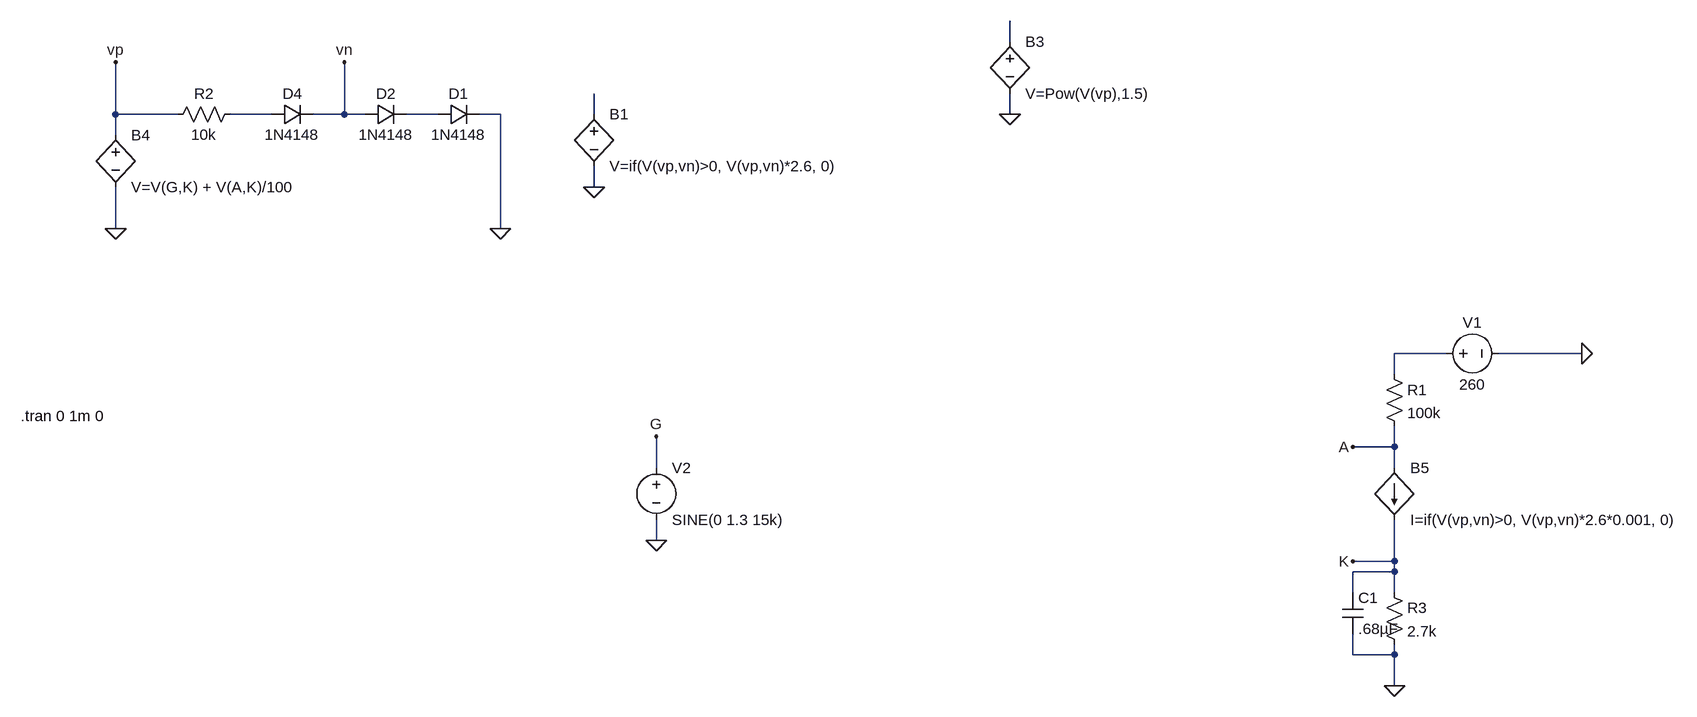
[diagram p0: schematic Test.asc]
Test.asc, the LTspice schematic file:
Version 4
SHEET 1 3920 996
WIRE 2832 -16 2832 -48
WIRE 1456 96 1456 16
WIRE 1552 96 1456 96
WIRE 1696 96 1632 96
WIRE 1808 96 1808 16
WIRE 1808 96 1760 96
WIRE 1840 96 1808 96
WIRE 1952 96 1904 96
WIRE 2048 96 2016 96
WIRE 2192 96 2192 64
WIRE 2832 96 2832 64
WIRE 1456 128 1456 96
WIRE 2192 208 2192 176
WIRE 1456 272 1456 208
WIRE 2048 272 2048 96
WIRE 3504 464 3424 464
WIRE 3712 464 3584 464
WIRE 3424 496 3424 464
WIRE 3424 608 3424 576
WIRE 3424 608 3360 608
WIRE 2288 640 2288 592
WIRE 3424 640 3424 608
WIRE 2288 752 2288 720
WIRE 3424 784 3424 720
WIRE 3424 784 3360 784
WIRE 3424 800 3424 784
WIRE 3424 800 3360 800
WIRE 3360 832 3360 800
WIRE 3424 832 3424 800
WIRE 3360 928 3360 896
WIRE 3424 928 3424 912
WIRE 3424 928 3360 928
WIRE 3424 976 3424 928
FLAG 2048 272 0
FLAG 1456 16 vp
FLAG 1808 16 vn
FLAG 2192 208 0
FLAG 2832 96 0
FLAG 1456 272 0
FLAG 3424 976 0
FLAG 3712 464 0
FLAG 2288 592 G
FLAG 2288 752 0
FLAG 3360 608 A
FLAG 3360 784 K
SYMBOL res 1648 80 R90
WINDOW 0 0 56 VBottom 2
WINDOW 3 32 56 VTop 2
SYMATTR InstName R2
SYMATTR Value 10k
SYMBOL diode 1840 112 R270
WINDOW 0 32 32 VTop 2
WINDOW 3 0 32 VBottom 2
SYMATTR InstName D2
SYMATTR Value 1N4148
SYMBOL diode 1696 112 R270
WINDOW 0 32 32 VTop 2
WINDOW 3 0 32 VBottom 2
SYMATTR InstName D4
SYMATTR Value 1N4148
SYMBOL bv 2192 80 R0
SYMATTR InstName B1
SYMATTR Value V=if(V(vp,vn)>0, V(vp,vn)*2.6, 0)
SYMBOL bv 2832 -32 R0
SYMATTR InstName B3
SYMATTR Value V=Pow(V(vp),1.5)
SYMBOL diode 1952 112 R270
WINDOW 0 32 32 VTop 2
WINDOW 3 0 32 VBottom 2
SYMATTR InstName D1
SYMATTR Value 1N4148
SYMBOL bv 1456 112 R0
SYMATTR InstName B4
SYMATTR Value V=V(G,K) + V(A,K)/100
SYMBOL bi 3424 640 R0
SYMATTR InstName B5
SYMATTR Value I=if(V(vp,vn)>0, V(vp,vn)*2.6*0.001, 0)
SYMBOL res 3408 480 R0
SYMATTR InstName R1
SYMATTR Value 100k
SYMBOL voltage 3488 464 R270
WINDOW 0 32 56 VTop 2
WINDOW 3 -32 56 VBottom 2
WINDOW 123 0 0 Left 0
WINDOW 39 0 0 Left 0
SYMATTR InstName V1
SYMATTR Value 260
SYMBOL voltage 2288 624 R0
WINDOW 123 0 0 Left 0
WINDOW 39 0 0 Left 0
SYMATTR InstName V2
SYMATTR Value SINE(0 1.3 15k)
SYMBOL res 3408 816 R0
SYMATTR InstName R3
SYMATTR Value 2.7k
SYMBOL cap 3344 832 R0
SYMATTR InstName C1
SYMATTR Value .68µF
TEXT 1310 560 Left 2 !.tran 0 1m 0

The netlist it stands for:
* Test.asc
R2 N002 vp 10k
D2 vn N003 1N4148
D4 N002 vn 1N4148
B1 N004 0 V=if(V(vp,vn)>0, V(vp,vn)*2.6, 0)
B3 N001 0 V=Pow(V(vp),1.5)
D1 N003 0 1N4148
B4 vp 0 V=V(G,K) + V(A,K)/100
B5 A K I=if(V(vp,vn)>0, V(vp,vn)*2.6*0.001, 0)
R1 N005 A 100k
V1 N005 0 260
V2 G 0 SINE(0 1.3 15k)
R3 K 0 2.7k
C1 K 0 .68µF
.model D D
.lib standard.dio
.tran 0 1m 0
.backanno
.end